# EAGLE design schematich (EAGLE 9.6.2)
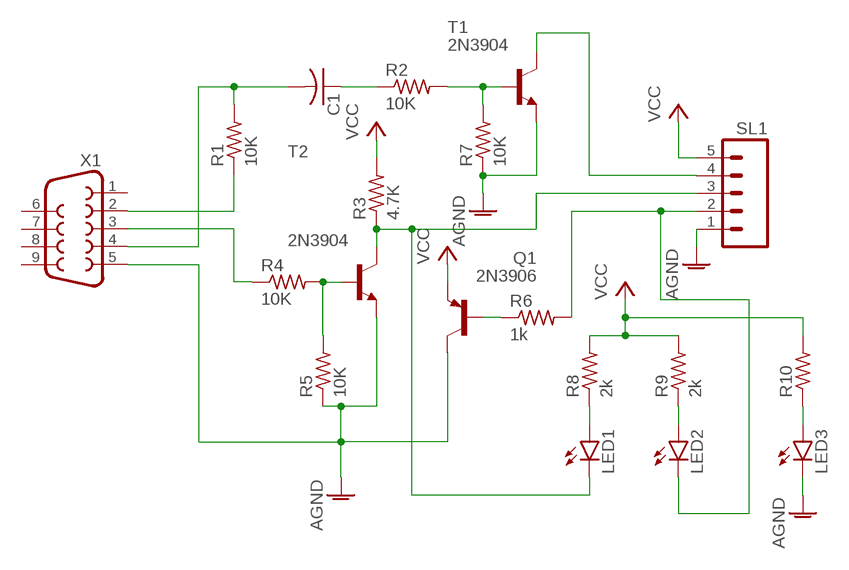
[diagram p0: schematic, sheet 1]

## Parts
C1  C-USC0805  [C0805]
LED1  LED3MM  [LED3MM]
LED2  LED3MM  [LED3MM]
LED3  LED3MM  [LED3MM]
Q1  2N3906  [TO92]
R1  10K  R-US_M1406  [M1406]
R2  10K  R-US_M1406  [M1406]
R3  4.7K  R-US_M1406  [M1406]
R4  10K  R-US_M1406  [M1406]
R5  10K  R-US_M1406  [M1406]
R6  1k  R-US_M1406  [M1406]
R7  10K  R-US_M1406  [M1406]
R8  2k  R-US_M0805  [M0805]
R9  2k  R-US_M0805  [M0805]
R10  R-US_M0805  [M0805]
SL1  M05  [05P]
T1  2N3904  [TO92]
T2  2N3904  [TO92]
X1  F09HP  [F09HP]

## Nets
AGND: LED3.K(C) Q1.1(C) R5.1 R7.1 SL1.1 T1.3(E) T2.3(E) X1.5
N$1: R1.1 X1.2
N$2: C1.2 R1.2 X1.4
N$3: C1.1 R2.1
N$4: R2.2 R7.2 T1.2(B)
N$5: Q1.2(B) R6.1
N$6: R4.2 R5.2 T2.2(B)
N$7: R4.1 X1.3
N$8: LED1.K(C) R3.1 SL1.3 T2.1(C)
N$9: LED2.K(C) R6.2 SL1.2
N$10: SL1.4 T1.1(C)
N$11: LED1.A R8.1
N$12: LED2.A R9.1
N$15: LED3.A R10.1
VCC: Q1.3(E) R3.2 R8.2 R9.2 R10.2 SL1.5
Unconnected: X1.1 X1.6 X1.7 X1.8 X1.9

## Library data of the parts
C1 = rcl:C-US: CAPACITOR, American symbol; SPICEPREFIX: C
LED1-LED3 = led:LED: LED OSRAM: - CHIPLED LG R971, LG N971, LY N971, LG Q971, LY Q971, LO R971, LY R971 LH N974, LH R974 LS Q976, LO Q976, LY Q976 LO Q996 - Hyper CHIPLED LW Q18S LB Q993, LB Q99A, LB R99A - SideLED LS A670, LO A670, LY A670, LG A670, LP A670 LB A673, LV A673, LT A673, LW A673 LH A674 LY A675 LS A676, LA A676, LO A676, LY A676, LW A676 LS A679, LY A679, LG A679 - Hyper Micro SIDELED® LS Y876, LA Y876, LO Y876, LY Y876 LT Y87S - SmartLED LW L88C, LW L88S LB L89C, LB L89S, LG L890 LS L89K, LO L89K, LY L89K LS L896, LA L896, LO L896, LY L896 - TOPLED LS T670, LO T670, LY T670, LG T670, LP T670 LSG T670, LSP T670, LSY T670, LOP T670, LYG T670 LG T671, LOG T671, LSG T671 LB T673, LV T673, LT T673, LW T673 LH T674 LS T676, LA T676, LO T676, LY T676, LB T676, LH T676, LSB T676, LW T676 LB T67C, LV T67C, LT T67C, LS T67K, LO T67K, LY T67K, LW E67C LS E67B, LA E67B, LO E67B, LY E67B, LB E67C, LV E67C, LT E67C LW T67C LS T679, LY T679, LG T679 LS T770, LO T770, LY T770, LG T770, LP T770 LB T773, LV T773, LT T773, LW T773 LH T774 LS E675, LA E675, LY E675, LS T675 LS T776, LA T776, LO T776, LY T776, LB T776 LHGB T686 LT T68C, LB T68C - Hyper Mini TOPLED® LB M676 - Mini TOPLED Santana® LG M470 LS M47K, LO M47K, LY M47K Source: http://www.osram.convergy.de LUXEON: - LUMILED® LXK2-PW12-R00, LXK2-PW12-S00, LXK2-PW14-U00, LXK2-PW14-V00 LXK2-PM12-R00, LXK2-PM12-S00, LXK2-PM14-U00 LXK2-PE12-Q00, LXK2-PE12-R00, LXK2-PE12-S00, LXK2-PE14-T00, LXK2-PE14-U00 LXK2-PB12-K00, LXK2-PB12-L00, LXK2-PB12-M00, LXK2-PB14-N00, LXK2-PB14-P00, LXK2-PB14-Q00 LXK2-PR12-L00, LXK2-PR12-M00, LXK2-PR14-Q00, LXK2-PR14-R00 LXK2-PD12-Q00, LXK2-PD12-R00, LXK2-PD12-S00 LXK2-PH12-R00, LXK2-PH12-S00 LXK2-PL12-P00, LXK2-PL12-Q00, LXK2-PL12-R00 Source: www.luxeon.com KINGBRIGHT: KA-3528ASYC Source: www.kingbright.com
Q1 = transistor-pnp:2N3906: PNP Transistor
R1-R10 = rcl:R-US_: RESISTOR, American symbol; SPICEPREFIX: R
SL1 = con-amp-quick:M05: AMP QUICK CONNECTOR; OC_FARNELL: unknown; OC_NEWARK: unknown
T1 T2 = transistor:2N3904: NPN TRANSISTOR
X1 = con-subd:F09: SUB-D; OC_FARNELL: unknown; OC_NEWARK: unknown

## Board
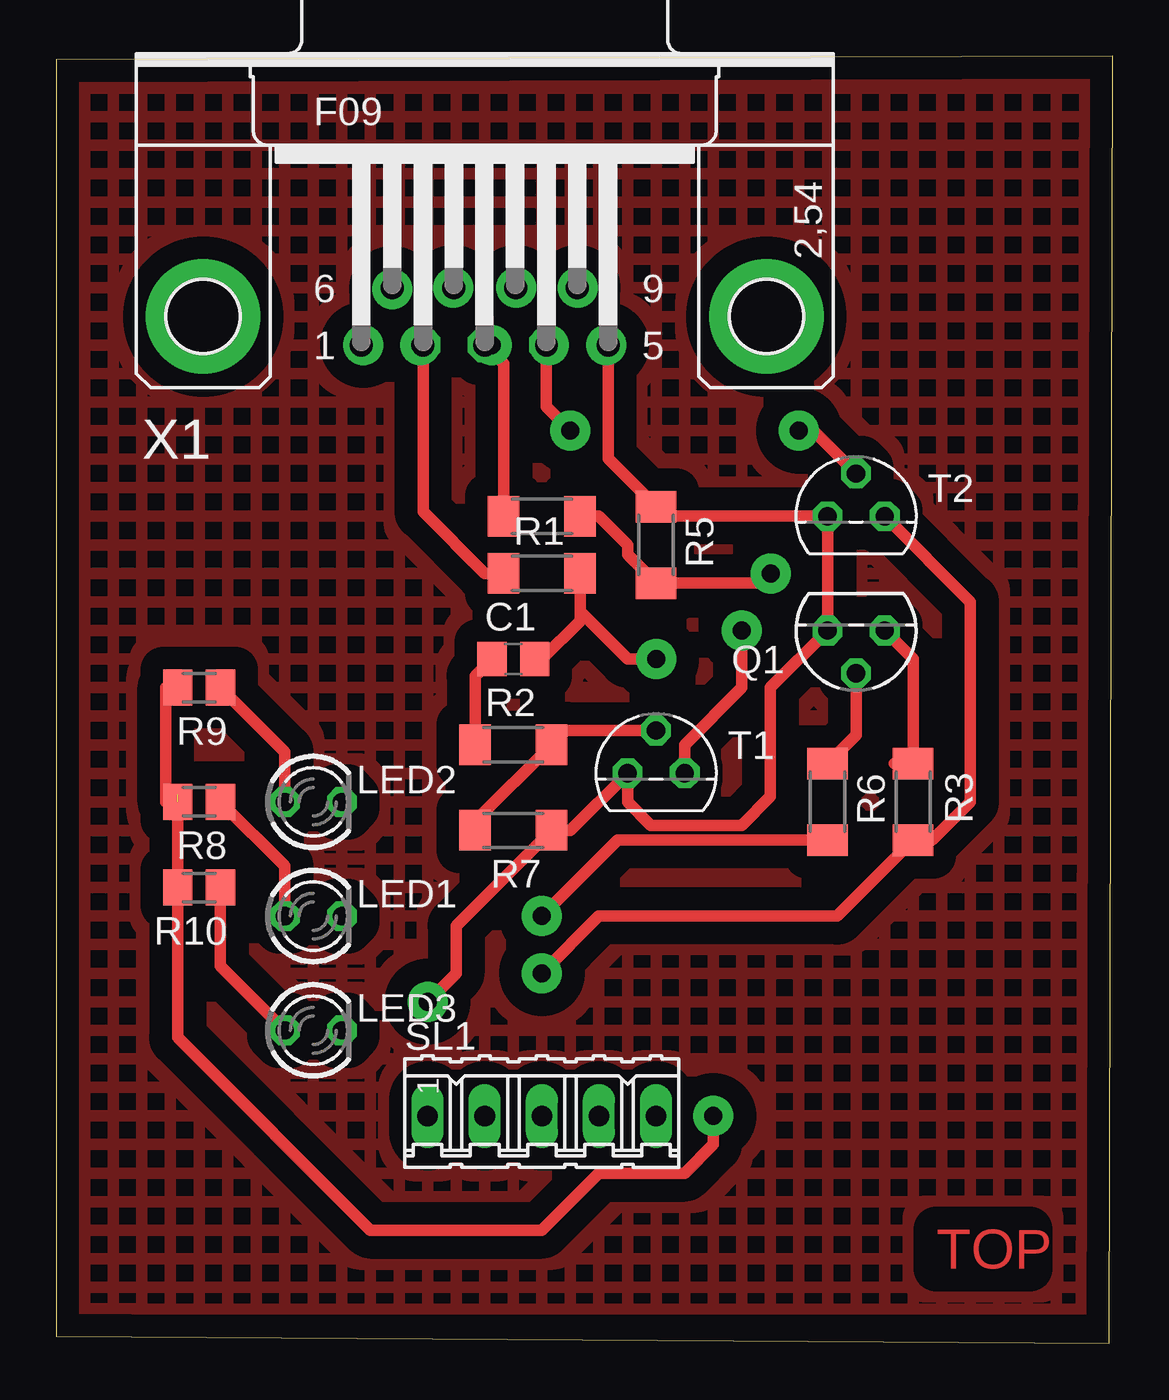
[diagram p1: board, top side]
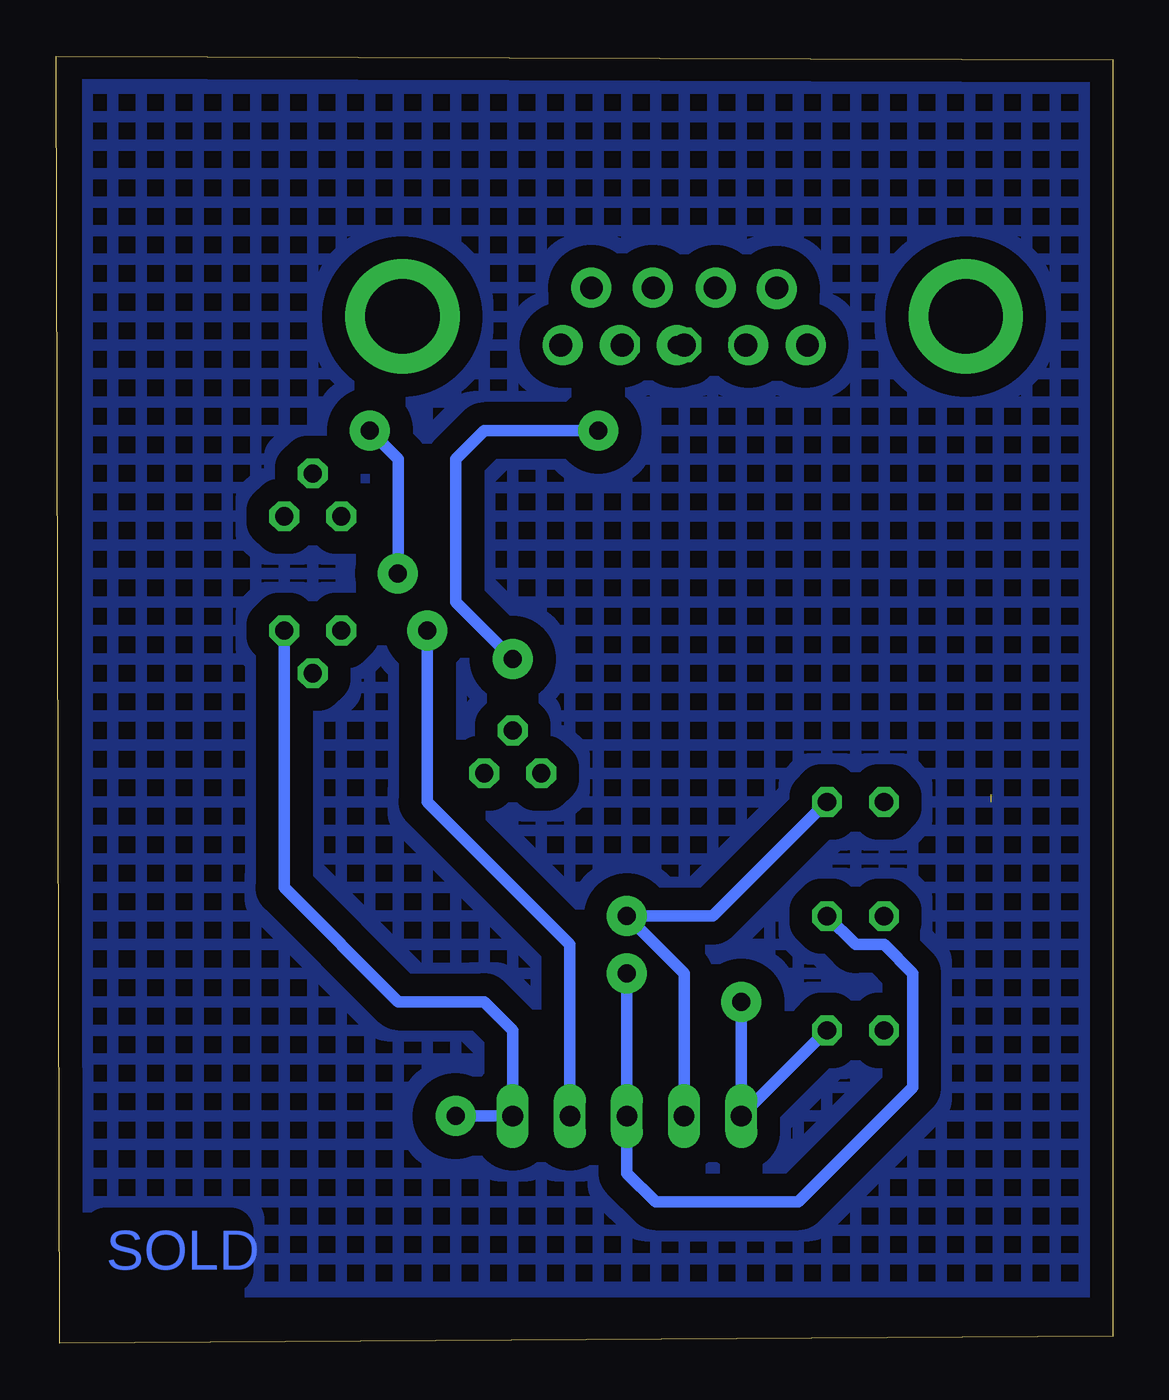
[diagram p2: board, bottom side, seen from below]

Size 46.96 x 57.24 mm. Coordinates in mm from the lower left corner, seen from the top.
Outline: 0,0.31 46.81,0 46.97,57.24 0,57.09 0,0.31
Copper layers (1*16): Top 0.035mm / dielectric 1.5mm / Bottom 0.035mm
Design rules "default": minimum track width 6mil, minimum drill 0.35mm, track to track 6mil, track to pad 6mil, pad to pad 6mil, via to via 6mil, smd to smd 6mil, copper to edge 40mil, drill to drill 6mil, minimum pad ring 10mil, minimum via ring 8mil, stop-mask expansion 4mil, vias tented up to drill 0mil, thermal gap 10mil

### Footprints (pad centres in the part's own frame; a part is rotated, then mirrored left to right if it is on the bottom)
C0805 = smd 1.3 x 1.5: 1 -0.95,0; 2 0.95,0
LED3MM = drill 0.813 octagon: A -1.27,0; K 1.27,0
TO92 = drill 0.813 octagon: 1 1.27,0; 2 0,1.905; 3 -1.27,0
M1406 = smd 1.4 x 1.8: 1 -1.7,0; 2 1.7,0
M0805 = smd 1.3 x 1.6: 1 -0.95,0; 2 0.95,0
05P = drill 0.914 long: 1 -5.08,0; 2 -2.54,0; 3 0,0; 4 2.54,0; 5 5.08,0
F09HP = drill 1.016 octagon: 1 -5.486,-1.27; 2 -2.743,-1.27; 3 0,-1.27; 4 2.743,-1.27; 5 5.486,-1.27; 6 -4.115,1.27; 7 -1.372,1.27; 8 1.372,1.27; 9 4.115,1.27 | drill 3.302 pad 5.08: G1 -12.522,0; G2 12.522,0

### Placement (x,y rotation side)
C1  20.32,30.43 0 top
LED1  11.43,19 0 top
LED2  11.43,24.08 0 top
LED3  11.43,13.92 0 top
Q1  35.56,31.7 180 top
R1  21.59,34.24 0 top
R2  20.32,26.62 0 top
R3  38.1,24.08 90 top
R4  21.59,36.78 0 top
R5  26.67,35.51 270 top
R6  34.29,24.08 270 top
R7  20.32,22.81 180 top
R8  6.35,24.08 180 top
R9  6.35,29.16 180 top
R10  6.35,20.27 180 top
SL1  21.59,10.11 0 top
T1  26.67,25.35 0 top
T2  35.56,36.78 0 top
X1  19.05,45.67 0 top

### Tracks (layer width: path | path; a pad name or v marks a point on that pad's centre or on a via)
AGND  (via drill 0.8 pad 1.78)
  Top 0.508: X1.5 24.54,39.34 R5.1 27.1,36.78 T2.3 Q1.1 31.75,29.16 31.75,24.31 30.48,23.04 26.44,23.04 25.4,24.08 T1.3 22.86,22.81 R7.1 17.78,18.57 17.78,16.46 v16.51,15.19
  Bottom 0.508: v16.51,15.19 SL1.1 LED3.K
GND
  pour Bottom (isolate 1.016, hatched): 0.36,56.9 45.57,56.9 45.57,2.29 0,2.29 0,56.9
  pour Top (isolate 1.016, hatched): 0.2,56.69 45.77,56.69 45.77,1.52 0.56,1.52 0.56,56.49
N$1
  Top 0.508: R1.1 19.05,34.24 16.31,36.98 X1.2
N$2  (via drill 0.8 pad 1.78)
  Top 0.508: X1.4 21.79,41.66 v22.86,40.59 | v26.67,30.43 25.4,30.43 23.29,32.54 R1.2 23.29,32.13 21.59,30.43 C1.2
  Bottom 0.508: v22.86,40.59 27.94,40.59 29.21,39.32 29.21,32.97 v26.67,30.43
N$3
  Top 0.508: C1.1 18.62,29.68 R2.1
N$4
  Top 0.508: T1.2 22.66,27.25 R2.2 18.62,23.22 R7.2
N$5
  Top 0.508: Q1.2 35.56,27.05 R6.1
N$6  (via drill 0.8 pad 1.78)
  Top 0.508: R4.2 24.13,36.78 25.4,35.51 25.4,35.08 R5.2 31.34,33.81 v31.77,34.24 | T2.2 33.66,40.59 v33.02,40.59
  Bottom 0.508: v33.02,40.59 31.75,39.32 31.75,34.24 v31.77,34.24
N$7
  Top 0.508: X1.3 19.89,43.56 R4.1
N$8  (via drill 0.8 pad 1.78)
  Top 0.508: T2.1 40.64,32.97 40.64,24.08 38.94,22.38 R3.1 34.72,19 24.13,19 v21.59,16.46
  Bottom 0.508: v21.59,16.46 SL1.3 21.59,7.57 20.32,6.3 13.97,6.3 8.89,11.38 8.89,16.46 10.16,17.73 11.43,17.73 LED1.K
N$9  (via drill 0.8 pad 1.78)
  Top 0.508: R6.2 24.97,22.38 v21.59,19
  Bottom 0.508: SL1.2 19.05,16.46 v21.59,19 17.78,19 LED2.K
N$10  (via drill 0.8 pad 1.78)
  Top 0.508: T1.1 27.94,26.62 30.48,29.16 v30.48,31.7
  Bottom 0.508: v30.48,31.7 30.48,24.08 24.13,17.73 SL1.4
N$11
  Top 0.508: R8.1 10.16,21.22 LED1.A
N$12
  Top 0.508: R9.1 10.16,26.3 LED2.A
N$13  (via drill 0.8 pad 1.78)
  other vias: 13.65,44.4
N$14  (via drill 0.8 pad 1.78)
  other vias: 16.19,44.4
N$15
  Top 0.508: R10.1 7.3,16.78 LED3.A
N$16  (via drill 0.8 pad 1.78)
  other vias: 21.91,44.4
N$17  (via drill 0.8 pad 1.78)
  other vias: 19.37,44.4
N$18  (via drill 0.8 pad 1.78)
  other vias: 24.45,44.4
N$19  (via drill 0.8 pad 1.78)
  other vias: 23.18,46.94
N$20  (via drill 0.8 pad 1.78)
  other vias: 20.45,46.94
N$21  (via drill 0.8 pad 1.78)
  other vias: 17.65,46.94
N$22  (via drill 0.8 pad 1.78)
  other vias: 14.94,46.89
VCC  (via drill 0.8 pad 1.78)  (1 unrouted)
  Top 0.508: Q1.3 38.1,30.43 R3.2 37.26,25.78 | 5.4,24.4 5.08,24.08 | v29.21,10.11 29.21,8.84 27.94,7.57 24.13,7.57 21.59,5.03 13.97,5.03 5.4,13.6 R10.2 R8.2 4.88,24.08 4.88,29.16 R9.2
  Bottom 0.508: Q1.3 36.83,20.27 31.75,15.19 27.94,15.19 26.67,13.92 SL1.5 v29.21,10.11

### Text on the board
Top: TOP
Bottom: SOLD